# EAGLE design Ilumitunes-IR-String-Controller-v13 (EAGLE 6.1)
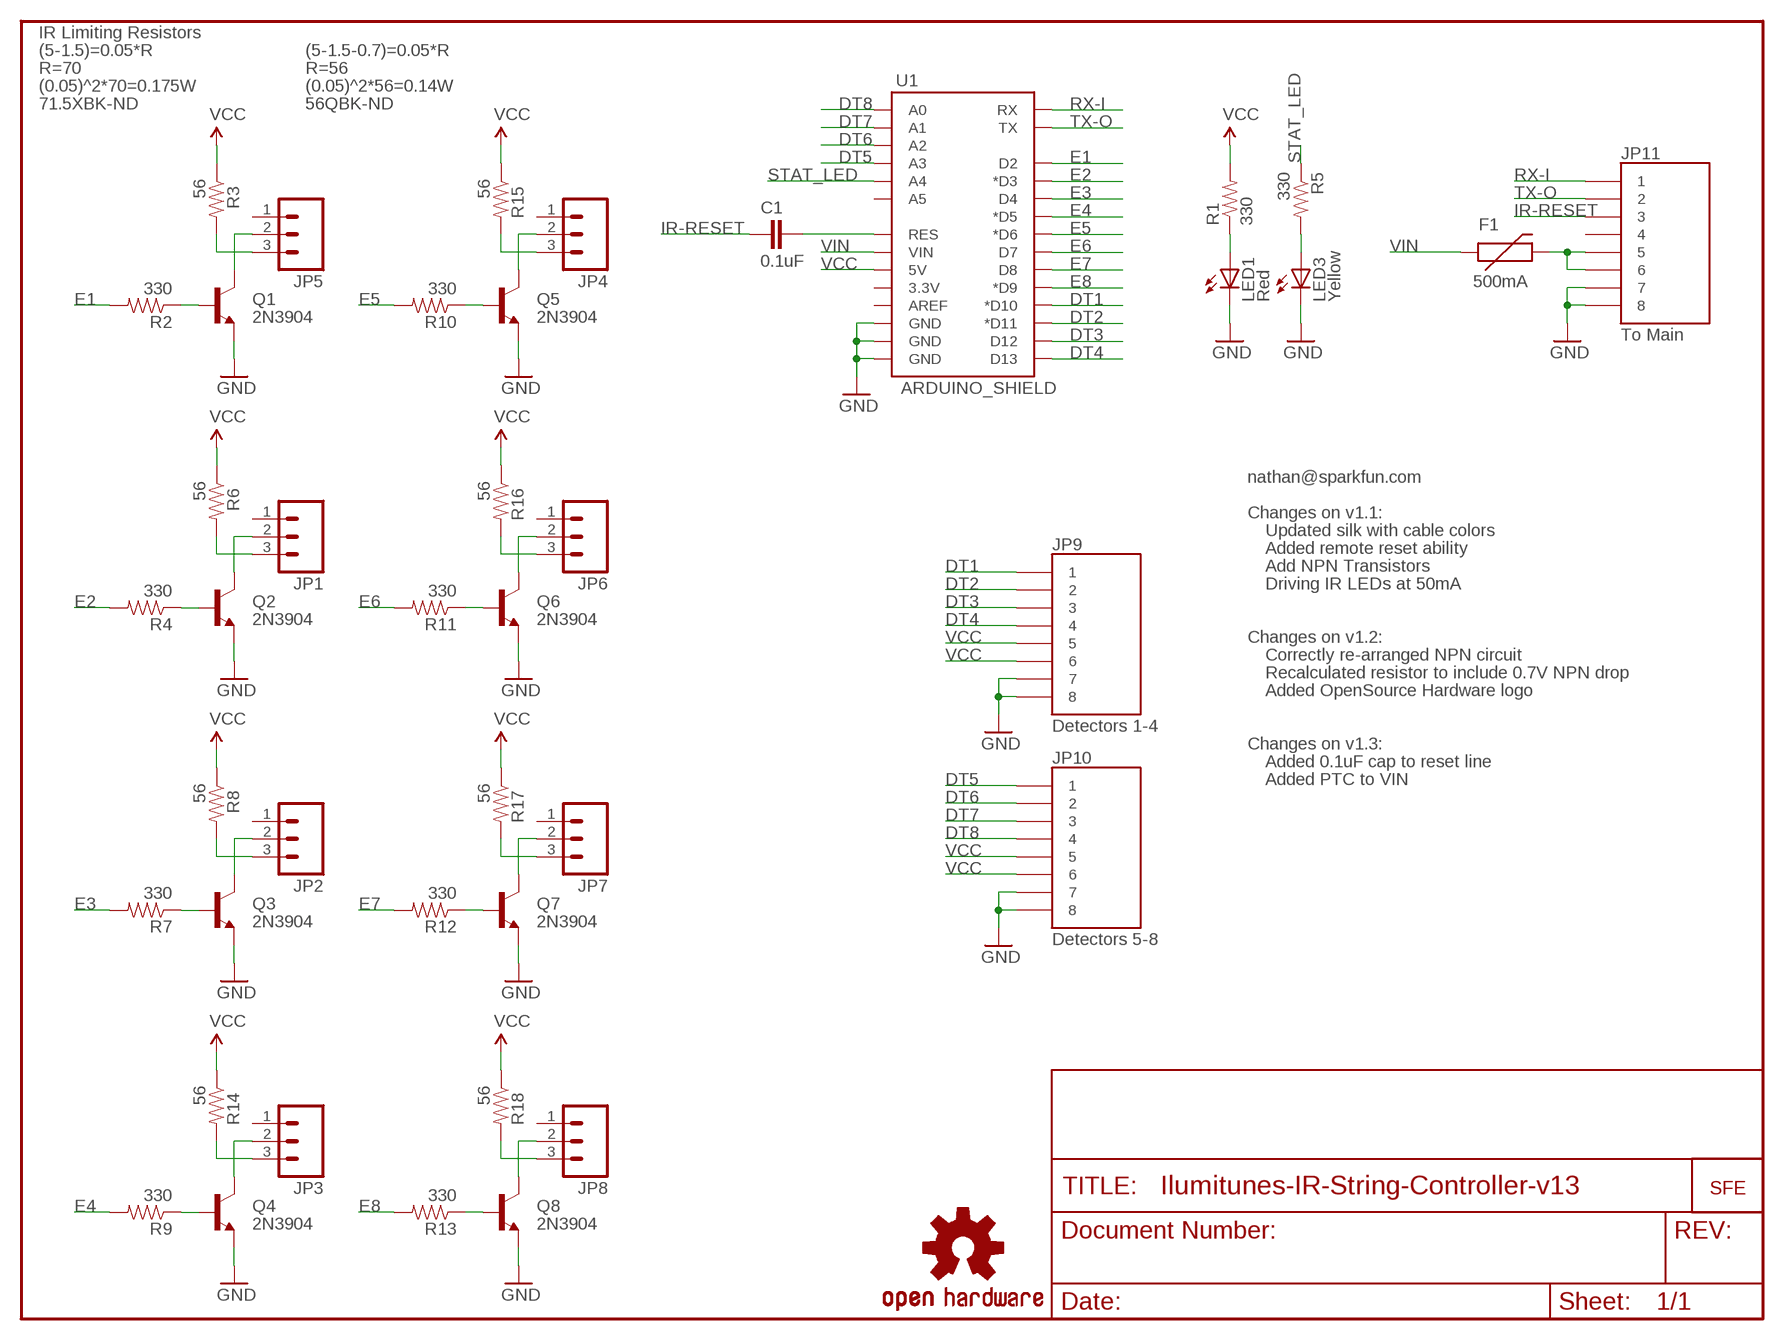
[diagram p0: schematic, sheet 1]

## Parts
C1  0.1uF  CAPPTH2  [CAP-PTH-SMALL2]
F1  500mA  PTCPTH  [PTC]
JP1  M03JST-PTH-VERT  [JST-3-PTH-VERT]
JP2  M03JST-PTH-VERT  [JST-3-PTH-VERT]
JP3  M03JST-PTH-VERT  [JST-3-PTH-VERT]
JP4  M03JST-PTH-VERT  [JST-3-PTH-VERT]
JP5  M03JST-PTH-VERT  [JST-3-PTH-VERT]
JP6  M03JST-PTH-VERT  [JST-3-PTH-VERT]
JP7  M03JST-PTH-VERT  [JST-3-PTH-VERT]
JP8  M03JST-PTH-VERT  [JST-3-PTH-VERT]
JP9  Detectors 1-4  RJ45-8PTH  [RJ45-8]
JP10  Detectors 5-8  RJ45-8PTH  [RJ45-8]
JP11  To Main  RJ45-8PTH  [RJ45-8]
LED1  Red  LED5MM  [LED5MM]
LED3  Yellow  LED5MM  [LED5MM]
Q1  2N3904  TRANSISTOR_NPNTO92  [TO-92]
Q2  2N3904  TRANSISTOR_NPNTO92  [TO-92]
Q3  2N3904  TRANSISTOR_NPNTO92  [TO-92]
Q4  2N3904  TRANSISTOR_NPNTO92  [TO-92]
Q5  2N3904  TRANSISTOR_NPNTO92  [TO-92]
Q6  2N3904  TRANSISTOR_NPNTO92  [TO-92]
Q7  2N3904  TRANSISTOR_NPNTO92  [TO-92]
Q8  2N3904  TRANSISTOR_NPNTO92  [TO-92]
R1  330  RESISTORAXIAL-0.3  [AXIAL-0.3]
R2  330  RESISTORAXIAL-0.3  [AXIAL-0.3]
R3  56  RESISTORAXIAL-0.3  [AXIAL-0.3]
R4  330  RESISTORAXIAL-0.3  [AXIAL-0.3]
R5  330  RESISTORAXIAL-0.3  [AXIAL-0.3]
R6  56  RESISTORAXIAL-0.3  [AXIAL-0.3]
R7  330  RESISTORAXIAL-0.3  [AXIAL-0.3]
R8  56  RESISTORAXIAL-0.3  [AXIAL-0.3]
R9  330  RESISTORAXIAL-0.3  [AXIAL-0.3]
R10  330  RESISTORAXIAL-0.3  [AXIAL-0.3]
R11  330  RESISTORAXIAL-0.3  [AXIAL-0.3]
R12  330  RESISTORAXIAL-0.3  [AXIAL-0.3]
R13  330  RESISTORAXIAL-0.3  [AXIAL-0.3]
R14  56  RESISTORAXIAL-0.3  [AXIAL-0.3]
R15  56  RESISTORAXIAL-0.3  [AXIAL-0.3]
R16  56  RESISTORAXIAL-0.3  [AXIAL-0.3]
R17  56  RESISTORAXIAL-0.3  [AXIAL-0.3]
R18  56  RESISTORAXIAL-0.3  [AXIAL-0.3]
U1  ARDUINO_SHIELD  ARDUINO_SHIELDNOHOLES  [DUEMILANOVE_SHIELD_NOHOLES]
U$1  LOGO-SFENEW  [SFE-NEW-WEBLOGO]
U$3  OSHW-LOGOS  [OSHW-LOGO-S]

## Nets
DT1: JP9.1 U1.D10(*D10)
DT2: JP9.2 U1.D11(*D11)
DT3: JP9.3 U1.D12
DT4: JP9.4 U1.D13
DT5: JP10.1 U1.A3
DT6: JP10.2 U1.A2
DT7: JP10.3 U1.A1
DT8: JP10.4 U1.A0
E1: R2.P$2 U1.D2
E2: R4.P$2 U1.D3(*D3)
E3: R7.P$2 U1.D4
E4: R9.P$2 U1.D5(*D5)
E5: R10.P$2 U1.D6(*D6)
E6: R11.P$2 U1.D7
E7: R12.P$2 U1.D8
E8: R13.P$2 U1.D9(*D9)
GND: JP9.7 JP9.8 JP10.7 JP10.8 JP11.7 JP11.8 LED1.K(C) LED3.K(C) Q1.1(E) Q2.1(E) Q3.1(E) Q4.1(E) Q5.1(E) Q6.1(E) Q7.1(E) Q8.1(E) U1.GND@0(GND) U1.GND@1(GND) U1.GND@2(GND)
IR-RESET: C1.1 JP11.3
N$1: LED1.A R1.P$1
N$2: Q1.2(B) R2.P$1
N$3: JP5.2 Q1.3(C)
N$4: LED3.A R5.P$2
N$5: JP5.3 R3.P$2
N$6: JP1.2 Q2.3(C)
N$7: JP3.2 Q4.3(C)
N$8: JP8.2 Q8.3(C)
N$9: Q2.2(B) R4.P$1
N$10: JP1.3 R6.P$2
N$11: Q3.2(B) R7.P$1
N$12: Q4.2(B) R9.P$1
N$13: Q6.2(B) R11.P$1
N$14: JP4.2 Q5.3(C)
N$15: JP6.3 R16.P$2
N$16: Q7.2(B) R12.P$1
N$17: JP2.3 R8.P$2
N$18: JP3.3 R14.P$2
N$19: Q5.2(B) R10.P$1
N$20: C1.2 U1.RES
N$21: JP4.3 R15.P$2
N$22: JP6.2 Q6.3(C)
N$23: JP7.3 R17.P$2
N$24: Q8.2(B) R13.P$1
N$25: JP7.2 Q7.3(C)
N$26: JP8.3 R18.P$2
N$27: JP2.2 Q3.3(C)
N$28: F1.P$2 JP11.5 JP11.6
RX-I: JP11.1 U1.RX
STAT_LED: R5.P$1 U1.A4
TX-O: JP11.2 U1.TX
VCC [vcc]: JP9.5 JP9.6 JP10.5 JP10.6 R1.P$2 R3.P$1 R6.P$1 R8.P$1 R14.P$1 R15.P$1 R16.P$1 R17.P$1 R18.P$1 U1.5V
VIN: F1.P$1 U1.VIN
Unconnected: JP1.1 JP2.1 JP3.1 JP4.1 JP5.1 JP6.1 JP7.1 JP8.1 JP11.4 U1.3.3V U1.A5 U1.AREF

## Notes on the sheet
- IR Limiting Resistors
- (5-1.5)=0.05*R | (5-1.5-0.7)=0.05*R
- R=70 | R=56
- (0.05)^2*70=0.175W | (0.05)^2*56=0.14W
- 71.5XBK-ND | 56QBK-ND
- nathan@sparkfun.com
- Changes on v1.1:
- Updated silk with cable colors
- Added remote reset ability
- Add NPN Transistors
- Driving IR LEDs at 50mA
- Changes on v1.2:
- Correctly re-arranged NPN circuit
- Recalculated resistor to include 0.7V NPN drop
- Added OpenSource Hardware logo
- Changes on v1.3:
- Added 0.1uF cap to reset line
- Added PTC to VIN

## Library data of the parts
C1 = SparkFun-Passives:CAP: Capacitor Standard 0603 ceramic capacitor, and 0.1" leaded capacitor.
F1 = SparkFun-PowerIC:PTC: Resettable Fuse PTC Resettable Fuse. Spark Fun Electronics SKU : COM-08357
JP1-JP8 = SparkFun:M03: Header 3 Standard 3-pin 0.1" header. Use with straight break away headers (SKU : PRT-00116), right angle break away headers (PRT-00553), swiss pins (PRT-00743), machine pins (PRT-00117), and female headers (PRT-00115). Molex polarized connector foot print use with SKU : PRT-08232 with associated crimp pins and housings.
JP9-JP11 = SparkFun:RJ45-8: RJ45 Jack Simple RJ45, 8-pin connection - connector for common Cat5, Cat5e, and Cat6 Ethernet cables. Footprint not yet proven in production. Connector sku is PRT-00643; Breakout PCB sku is BOB-00716.
LED1 LED3 = SparkFun:LED: LEDs Standard schematic elements and footprints for 5mm, 3mm, 1206, and 0603 sized LEDs. 5mm - Spark Fun Electronics SKU : COM-00529 (and others)
Q1-Q8 = SparkFun:TRANSISTOR_NPN: Transistor NPN BJT configuration in SOT23 package. MMBT2222 is the common NPN we use. Double check BCE configuration again layout.
R1-R18 = SparkFun:RESISTOR: Resistor Basic schematic elements and footprints for 0603, 1206, and PTH resistors.
U1 = SparkFun:ARDUINO_SHIELD
U$1 = SparkFun:LOGO-SFE: Spark Fun Electronics PCB Logo This is the standard Spark Fun Electronics PCB logo.
U$3 = SparkFun:OSHW-LOGO: Open Source Hardware Logo This logo indicates the piece of hardware it is found on incorporates a OSHW license and/or adheres to the definition of open source hardware found here: http://freedomdefined.org/OSHW

## Net classes
1 vcc: width 0.508 mm

## Board
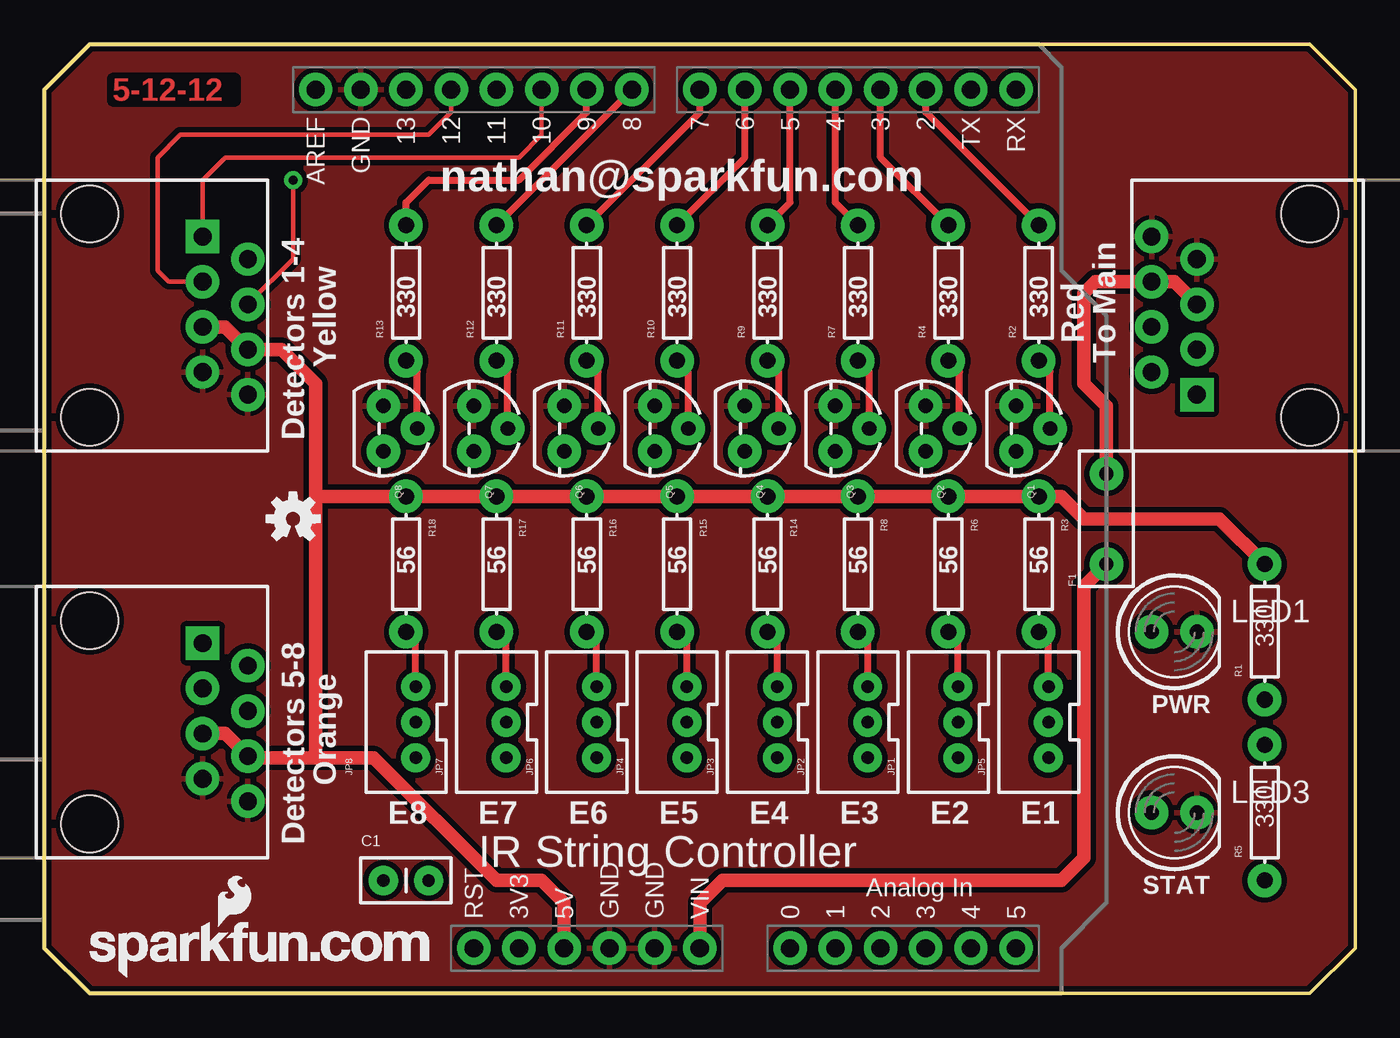
[diagram p1: board, top side]
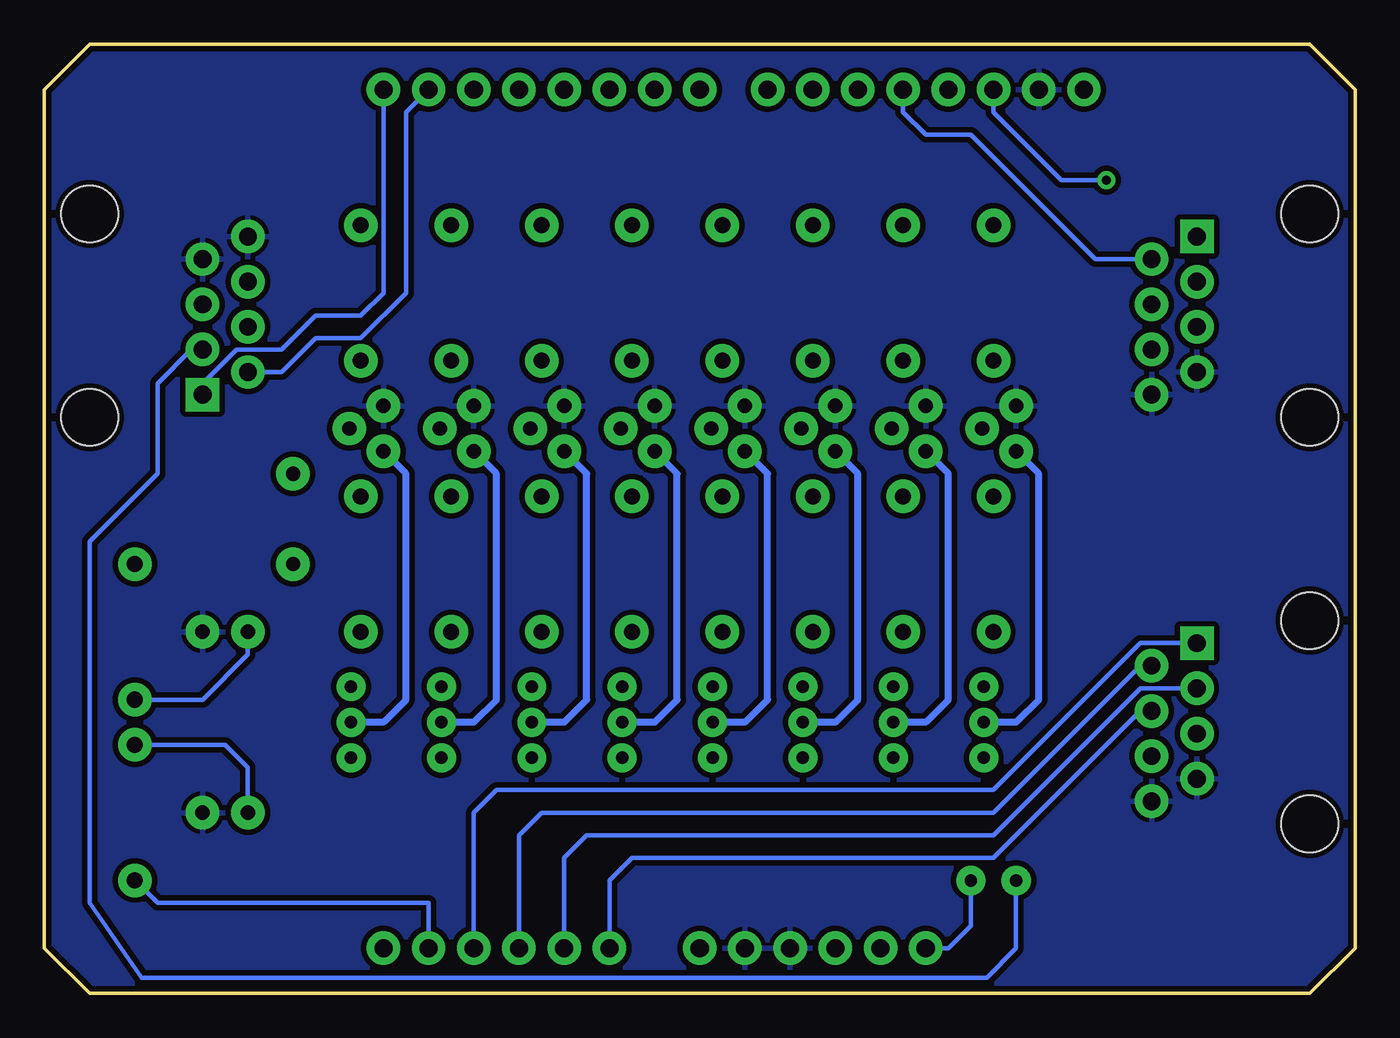
[diagram p2: board, bottom side, seen from below]

Size 73.66 x 53.34 mm. Coordinates in mm from the lower left corner, seen from the top.
Outline: 2.54,0 71.12,0 73.66,2.54 73.66,50.8 71.12,53.34 2.54,53.34 0,50.8 0,2.54 2.54,0
Copper layers (1*16): Top 0.035mm / dielectric 1.5mm / Bottom 0.035mm
Design rules: minimum track width 10mil, minimum drill 20mil, track to track 8mil, track to pad 8mil, pad to pad 8mil, via to via 8mil, smd to smd 8mil, copper to edge 10mil, drill to drill 8mil, minimum pad ring 12mil, minimum via ring 10mil, stop-mask expansion 4mil, vias tented up to drill 25mil, thermal gap 10mil

### Footprints (pad centres in the part's own frame; a part is rotated, then mirrored left to right if it is on the bottom)
CAP-PTH-SMALL2 = drill 0.7 pad 1.651: 1 0,0; 2 2.54,0
PTC = drill 0.8 pad 1.88: P$1 -2.54,0; P$2 2.54,0
JST-3-PTH-VERT = drill 0.7 pad 1.626: 1 -2,-0.55; 2 0,-0.55; 3 2,-0.55
RJ45-8 = drill 1 pad 1.88 square: 1 -4.445,6.35 | drill 1 pad 1.88: 2 -3.175,8.89; 3 -1.905,6.35; 4 -0.635,8.89; 5 0.635,6.35; 6 1.905,8.89; 7 3.175,6.35; 8 4.445,8.89 | hole 3.2: -5.715,0; 5.715,0
LED5MM = drill 0.813 pad 1.88: A -1.27,0; K 1.27,0
TO-92 = drill 0.813 pad 1.88: 1 -1.27,0; 2 0,1.905; 3 1.27,0
AXIAL-0.3 = drill 0.9 pad 1.88: P$1 -3.81,0; P$2 3.81,0
DUEMILANOVE_SHIELD_NOHOLES = drill 1.016 pad 1.88: 3.3V 50.8,26.67; 5V 50.8,29.21; A0 50.8,41.91; A1 50.8,44.45; A2 50.8,46.99; A3 50.8,49.53; A4 50.8,52.07; A5 50.8,54.61; AREF 2.54,15.24; D2 2.54,49.53; D3 2.54,46.99; D4 2.54,44.45; D5 2.54,41.91; D6 2.54,39.37; D7 2.54,36.83; D8 2.54,33.02; D9 2.54,30.48; D10 2.54,27.94; D11 2.54,25.4; D12 2.54,22.86; D13 2.54,20.32; GND@0 50.8,31.75; GND@1 50.8,34.29; GND@2 2.54,17.78; RES 50.8,24.13; RX 2.54,54.61; TX 2.54,52.07; VIN 50.8,36.83

### Placement (x,y rotation side)
C1  19.05,6.35 0 top
F1  59.69,26.67 90 top
JP1  50.8,15.24 90 top
JP2  45.72,15.24 90 top
JP3  40.64,15.24 90 top
JP4  35.56,15.24 90 top
JP5  55.88,15.24 90 top
JP6  30.48,15.24 90 top
JP7  25.4,15.24 90 top
JP8  20.32,15.24 90 top
JP9  2.54,38.1 270 top
JP10  2.54,15.24 270 top
JP11  71.12,38.1 90 top
LED1  63.5,20.32 0 top
LED3  63.5,10.16 0 top
Q1  54.61,31.75 270 top
Q2  49.53,31.75 270 top
Q3  44.45,31.75 270 top
Q4  39.37,31.75 270 top
Q5  34.29,31.75 270 top
Q6  29.21,31.75 270 top
Q7  24.13,31.75 270 top
Q8  19.05,31.75 270 top
R1  68.58,20.32 90 top
R2  55.88,39.37 90 top
R3  55.88,24.13 270 top
R4  50.8,39.37 90 top
R5  68.58,10.16 90 top
R6  50.8,24.13 270 top
R7  45.72,39.37 90 top
R8  45.72,24.13 270 top
R9  40.64,39.37 90 top
R10  35.56,39.37 90 top
R11  30.48,39.37 90 top
R12  25.4,39.37 90 top
R13  20.32,39.37 90 top
R14  40.64,24.13 270 top
R15  35.56,24.13 270 top
R16  30.48,24.13 270 top
R17  25.4,24.13 270 top
R18  20.32,24.13 270 top
U1  0,53.34 270 top
U$1  2.54,0.89 0 top
U$3  13.97,26.67 0 top

### Tracks (layer width: path | path; a pad name or v marks a point on that pad's centre or on a via)
DT1
  Top 0.254: JP9.1 8.89,45.72 10.16,46.99 26.67,46.99 27.94,48.26 U1.D10
DT2
  Bottom 0.254: JP9.2 14.61,41.27 21.59,48.26 24.13,48.26 25.4,49.53 U1.D11
DT3
  Top 0.254: JP9.3 6.99,40.01 6.35,40.64 6.35,46.99 7.62,48.26 21.59,48.26 22.86,49.53 U1.D12
DT4  (via drill 0.51)
  Top 0.254: v13.97,45.72 13.97,41.27 JP9.4
  Bottom 0.254: U1.D13 20.32,49.53 16.51,45.72 v13.97,45.72
DT5
  Bottom 0.254: U1.A3 49.53,10.16 48.26,11.43 20.32,11.43 12.06,19.68 JP10.1
DT6
  Bottom 0.254: JP10.2 12.06,18.41 20.32,10.16 45.72,10.16 46.99,8.89 U1.A2
DT7
  Bottom 0.254: JP10.3 12.06,17.14 20.32,8.89 43.18,8.89 44.45,7.62 U1.A1
DT8
  Bottom 0.254: U1.A0 41.91,6.35 40.64,7.62 20.32,7.62 12.06,15.88 JP10.4
E1
  Top 0.406: U1.D2 49.53,49.53 R2.P$2
E2
  Top 0.406: U1.D3 46.99,46.99 R4.P$2
E3
  Top 0.406: U1.D4 44.45,44.45 R7.P$2
E4
  Top 0.406: U1.D5 41.91,44.45 R9.P$2
E5
  Top 0.406: U1.D6 39.37,46.99 R10.P$2
E6
  Top 0.406: U1.D7 36.83,49.53 R11.P$2
E7
  Top 0.406: R12.P$2 U1.D8
E8
  Top 0.406: U1.D9 30.48,49.53 26.67,45.72 21.59,45.72 20.32,44.45 R13.P$2
GND
  pour Top (isolate 0.305): 0,0 0,53.34 73.66,53.34 73.66,0
  pour Bottom (isolate 0.305): 0,0 0,53.34 73.66,53.34 73.66,0
IR-RESET
  Bottom 0.254: JP11.3 65.41,36.2 67.31,34.29 67.31,29.21 71.12,25.4 71.12,5.08 68.2,0.89 20.7,0.89 19.05,2.54 C1.1
N$1
  Bottom 0.254: R1.P$1 64.77,16.51 62.23,19.05 LED1.A
N$2
  Top 0.406: Q1.2 56.52,34.92 R2.P$1
N$3
  Bottom 0.406: JP5.2 54.61,15.24 53.34,16.51 53.34,29.21 Q1.3
N$4
  Bottom 0.254: R5.P$2 63.5,13.97 62.23,12.7 LED3.A
N$5
  Top 0.406: JP5.3 56.43,19.77 R3.P$2
N$6
  Bottom 0.406: JP1.2 49.53,15.24 48.26,16.51 48.26,29.21 Q2.3
N$7
  Bottom 0.406: JP3.2 39.37,15.24 38.1,16.51 38.1,29.21 Q4.3
N$8
  Bottom 0.406: JP8.2 19.05,15.24 17.78,16.51 17.78,29.21 Q8.3
N$9
  Top 0.406: Q2.2 51.44,34.92 R4.P$1
N$10
  Top 0.406: JP1.3 51.35,19.77 R6.P$2
N$11
  Top 0.406: Q3.2 46.35,34.92 R7.P$1
N$12
  Top 0.406: Q4.2 41.27,34.92 R9.P$1
N$13
  Top 0.406: Q6.2 31.11,34.92 R11.P$1
N$14
  Bottom 0.406: JP4.2 34.29,15.24 33.02,16.51 33.02,29.21 Q5.3
N$15
  Top 0.406: JP6.3 31.03,19.77 R16.P$2
N$16
  Top 0.406: Q7.2 26.04,34.92 R12.P$1
N$17
  Top 0.406: JP2.3 46.27,19.77 R8.P$2
N$18
  Top 0.406: JP3.3 41.19,19.77 R14.P$2
N$19
  Top 0.406: Q5.2 36.2,34.92 R10.P$1
N$20
  Bottom 0.254: U1.RES 22.86,2.54 21.59,3.81 C1.2
N$21
  Top 0.406: JP4.3 36.11,19.77 R15.P$2
N$22
  Bottom 0.406: JP6.2 29.21,15.24 27.94,16.51 27.94,29.21 Q6.3
N$23
  Top 0.406: JP7.3 25.95,19.77 R17.P$2
N$24
  Top 0.406: Q8.2 20.95,34.92 R13.P$1
N$25
  Bottom 0.406: JP7.2 24.13,15.24 22.86,16.51 22.86,29.21 Q7.3
N$26
  Top 0.406: JP8.3 20.87,19.77 R18.P$2
N$27
  Bottom 0.406: JP2.2 44.45,15.24 43.18,16.51 43.18,29.21 Q3.3
N$28
  Top 0.762: F1.P$2 59.69,33.02 58.42,34.29 58.42,39.37 59.05,40.01 JP11.6 63.5,40.01 JP11.5
RX-I
  Bottom 0.254: U1.RX 54.61,39.37 55.88,38.1 58.42,38.1 60.33,36.2 62.87,36.2 64.77,34.29 JP11.1
STAT_LED
  Bottom 0.254: U1.A4 52.07,5.08 67.31,5.08 R5.P$1
TX-O
  Bottom 0.254: U1.TX 53.34,49.53 53.34,39.37 55.88,36.83 58.42,36.83 60.33,34.92 JP11.2
VCC
  Top 0.762: JP9.5 10.16,37.47 JP9.6 13.34,36.2 15.24,34.29 15.24,27.94 | JP10.5 10.16,14.61 JP10.6 11.53,13.24 15.24,13.24 | 15.24,13.24 18.51,13.24 25.4,6.35 27.94,6.35 29.21,5.08 U1.5V | 15.24,13.24 15.24,27.94 | 15.24,27.94 R18.P$1 R17.P$1 R16.P$1 R15.P$1 R14.P$1 R8.P$1 R6.P$1 R3.P$1 57.15,27.94 58.42,26.67 66.04,26.67 R1.P$2
VIN
  Top 0.762: U1.VIN 36.83,5.08 38.1,6.35 57.15,6.35 58.42,7.62 58.42,22.86 F1.P$1

### Text on the board
Top: 5-12-12
tPlace: nathan@sparkfun.com | Red | Yellow | To Main | Detectors 1-4 | PWR | Orange | E8 | E7 | E6 | E5 | E4 | E3 | E2 | E1 | Detectors 5-8 | IR String Controller | STAT